# EAGLE design macropad (EAGLE 8.2.0)
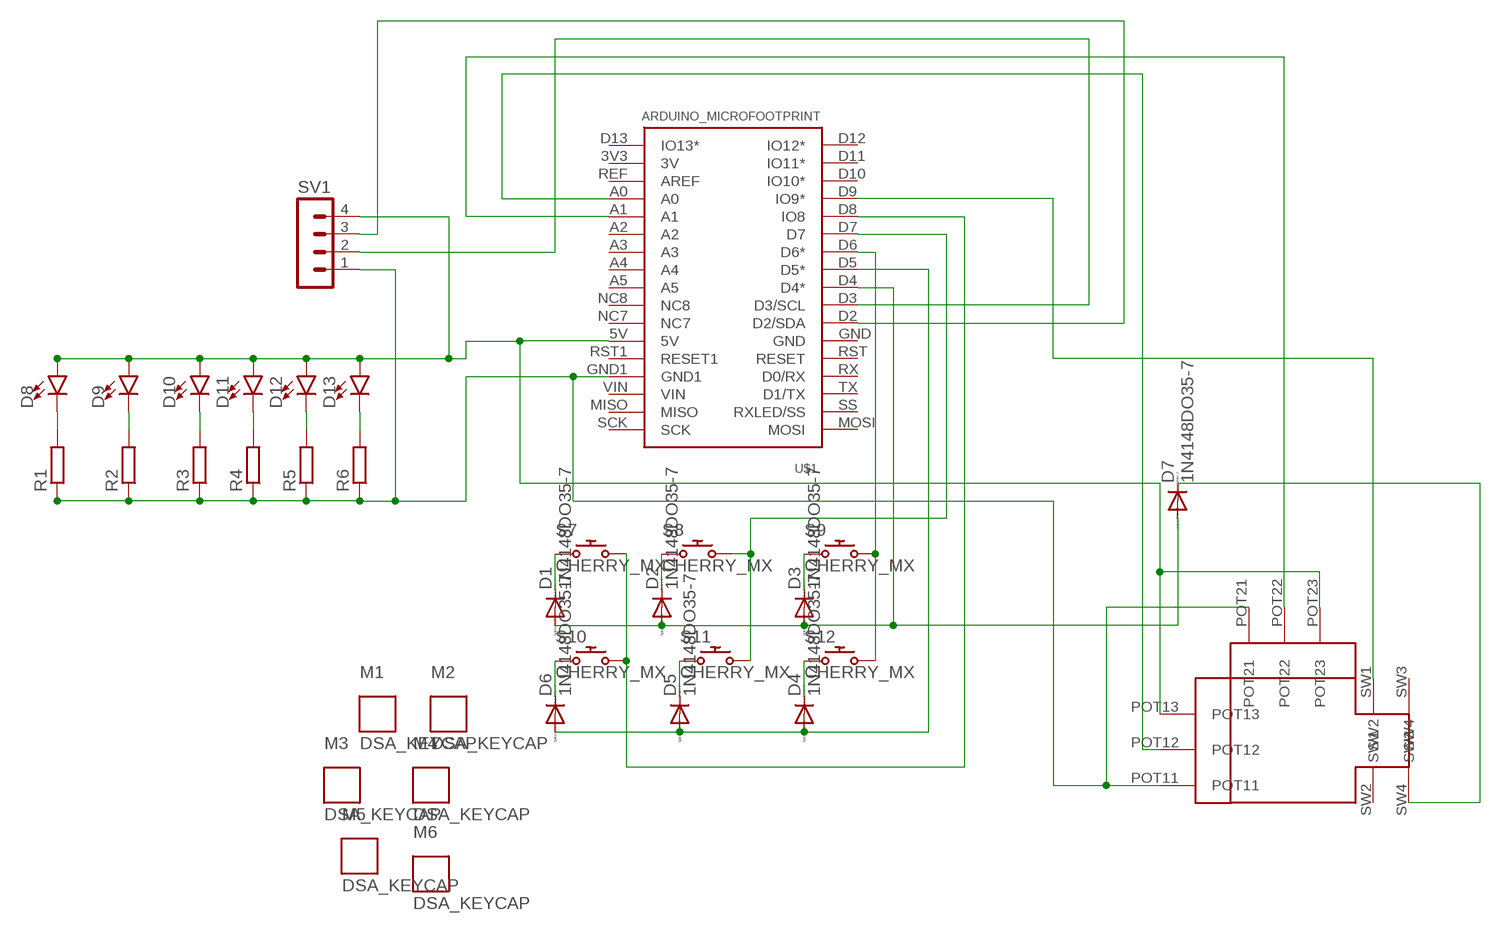
[diagram p0: schematic, sheet 1]

## Parts
D1  1N4148DO35-7  [DO35-7]
D2  1N4148DO35-7  [DO35-7]
D3  1N4148DO35-7  [DO35-7]
D4  1N4148DO35-7  [DO35-7]
D5  1N4148DO35-7  [DO35-7]
D6  1N4148DO35-7  [DO35-7]
D7  1N4148DO35-7  [DO35-7]
D8  LED-3MM-NO_SILK  [LED_3MM-NS]
D9  LED-3MM-NO_SILK  [LED_3MM-NS]
D10  LED-3MM-NO_SILK  [LED_3MM-NS]
D11  LED-3MM-NO_SILK  [LED_3MM-NS]
D12  LED-3MM-NO_SILK  [LED_3MM-NS]
D13  LED-3MM-NO_SILK  [LED_3MM-NS]
M1  DSA_KEYCAP  [DSA_KEYCAP]
M2  DSA_KEYCAP  [DSA_KEYCAP]
M3  DSA_KEYCAP  [DSA_KEYCAP]
M4  DSA_KEYCAP  [DSA_KEYCAP]
M5  DSA_KEYCAP  [DSA_KEYCAP]
M6  DSA_KEYCAP  [DSA_KEYCAP]
R1  R-EU_0204/7  [0204/7]
R2  R-EU_0204/7  [0204/7]
R3  R-EU_0204/7  [0204/7]
R4  R-EU_0204/7  [0204/7]
R5  R-EU_0204/7  [0204/7]
R6  R-EU_0204/7  [0204/7]
S7  CHERRY_MX  [CHERRY_MX]
S8  CHERRY_MX  [CHERRY_MX]
S9  CHERRY_MX  [CHERRY_MX]
S10  CHERRY_MX  [CHERRY_MX]
S11  CHERRY_MX  [CHERRY_MX]
S12  CHERRY_MX  [CHERRY_MX]
SV1  MA04-1  [MA04-1]
U$1  ARDUINO_MICROFOOTPRINT  [ARDUINO-MICRO]
U$2  JOYSTICK  [JOYSTICKONE]

## Nets
N$1: D5.C S11.S1
N$2: D1.C S7.S1
N$3: D6.C S10.S1
N$4: S7.S2 S10.S2 U$1.D8(IO8)
N$5: D2.C S8.S1
N$6: D3.C S9.S1
N$7: SV1.2 U$1.D3(D3/SCL)
N$9: S9.S2 S12.S2 U$1.D6(D6*)
N$10: D7.C U$2.SW4
N$11: D1.A D2.A D3.A D7.A U$1.D4(D4*)
N$12: D4.A D5.A D6.A U$1.D5(D5*)
N$14: SV1.3 U$1.D2(D2/SDA)
N$15: U$1.A0 U$2.POT12
N$16: U$1.A1 U$2.POT22
N$17: D4.C S12.S1
N$18: S8.S2 S11.S2 U$1.D7
N$23: U$1.D9(IO9*) U$2.SW1
N$24: D8.A D9.A D10.A D11.A D12.A D13.A SV1.4 U$1.5V U$2.POT13 U$2.POT23
N$25: D8.K(C) R1.2
N$26: D9.K(C) R2.2
N$27: D10.K(C) R3.2
N$28: D11.K(C) R4.2
N$29: D12.K(C) R5.2
N$30: D13.K(C) R6.2
N$31: R1.1 R2.1 R3.1 R4.1 R5.1 R6.1 SV1.1 U$1.GND1 U$2.POT11 U$2.POT21
Unconnected: U$1.3V3(3V) U$1.A2 U$1.A3 U$1.A4 U$1.A5 U$1.D10(IO10*) U$1.D11(IO11*) U$1.D12(IO12*) U$1.D13(IO13*) U$1.GND U$1.MISO U$1.MOSI U$1.NC7 U$1.NC8 U$1.REF(AREF) U$1.RST1(RESET1) U$1.RST(RESET) U$1.RX(D0/RX) U$1.SCK U$1.SS(RXLED/SS) U$1.TX(D1/TX) U$1.VIN U$2.SW2 U$2.SW3

## Library data of the parts
D1-D7 = diode:1N4148: DIODE high speed (Philips)
D8-D13 = ws2812b:LED: LED (Generic) Standard schematic elements and footprints for 5mm, 3mm, 1206, and 0603 sized LEDs. Generic LEDs with no color specified.
M1-M6 = cherry:DSA_KEYCAP: DSA keycap
R1-R6 = rcl:R-EU_: RESISTOR, European symbol
S7-S12 = cherry:CHERRY_MX: Cherry keymodule MX; FARNELL: 2292961; MOUSER: 540-MX1A-11NW
SV1 = con-lstb:MA04-1: PIN HEADER; OC_FARNELL: unknown; OC_NEWARK: unknown
U$1 = ArduinoMicro:ARDUINO_MICRO
U$2 = joystick one:JOYSTICK

## Board
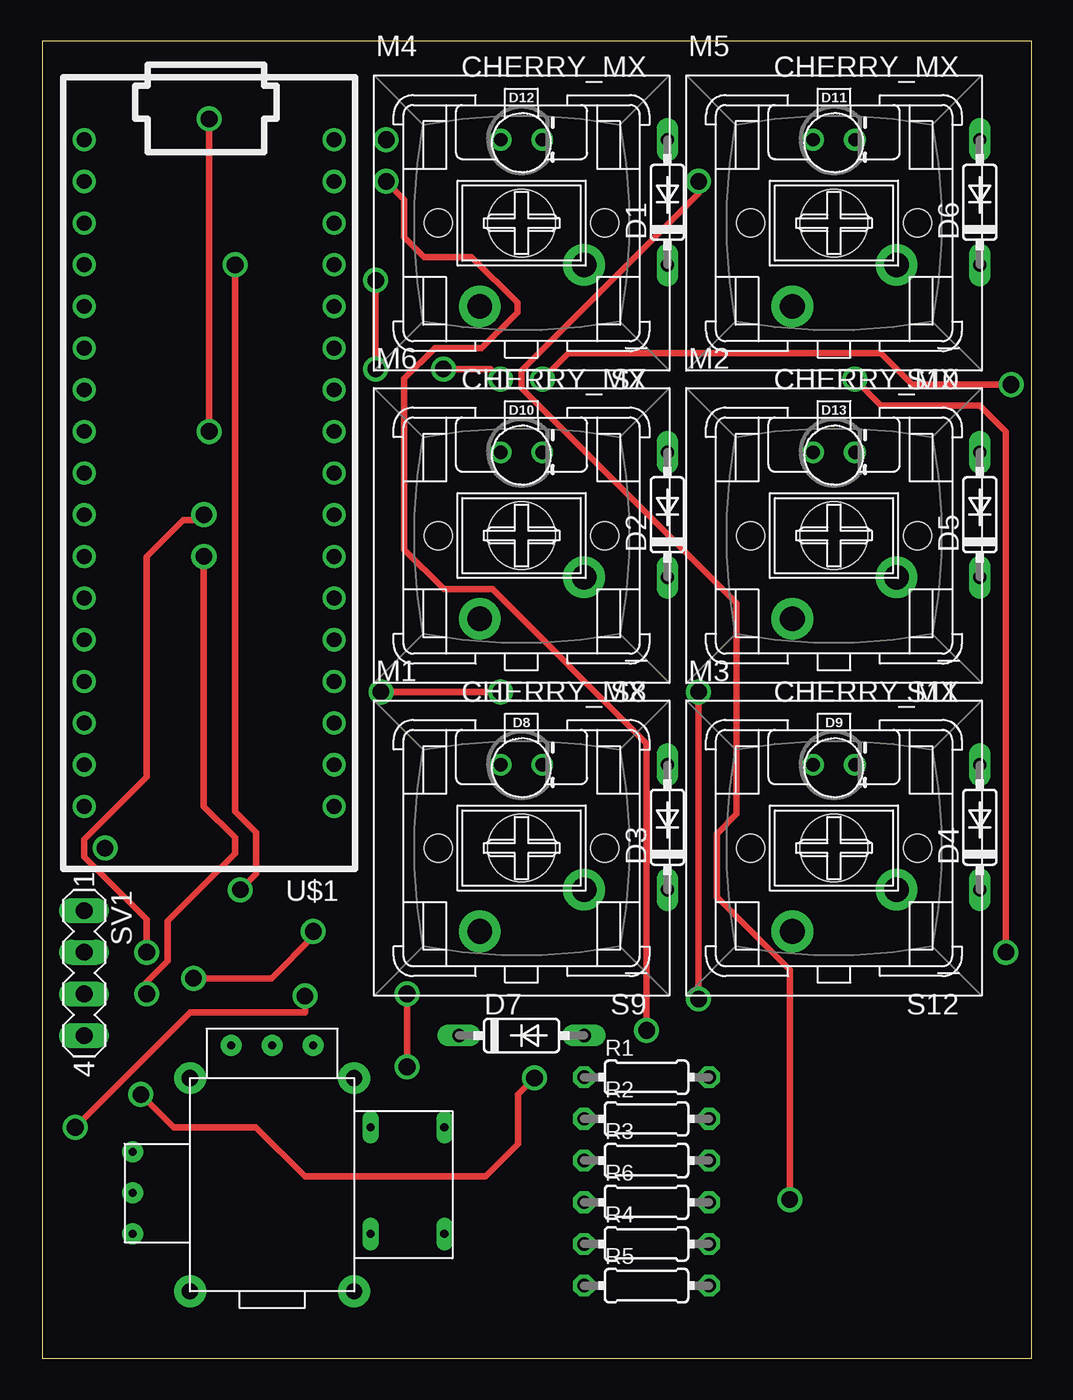
[diagram p1: board, top side]
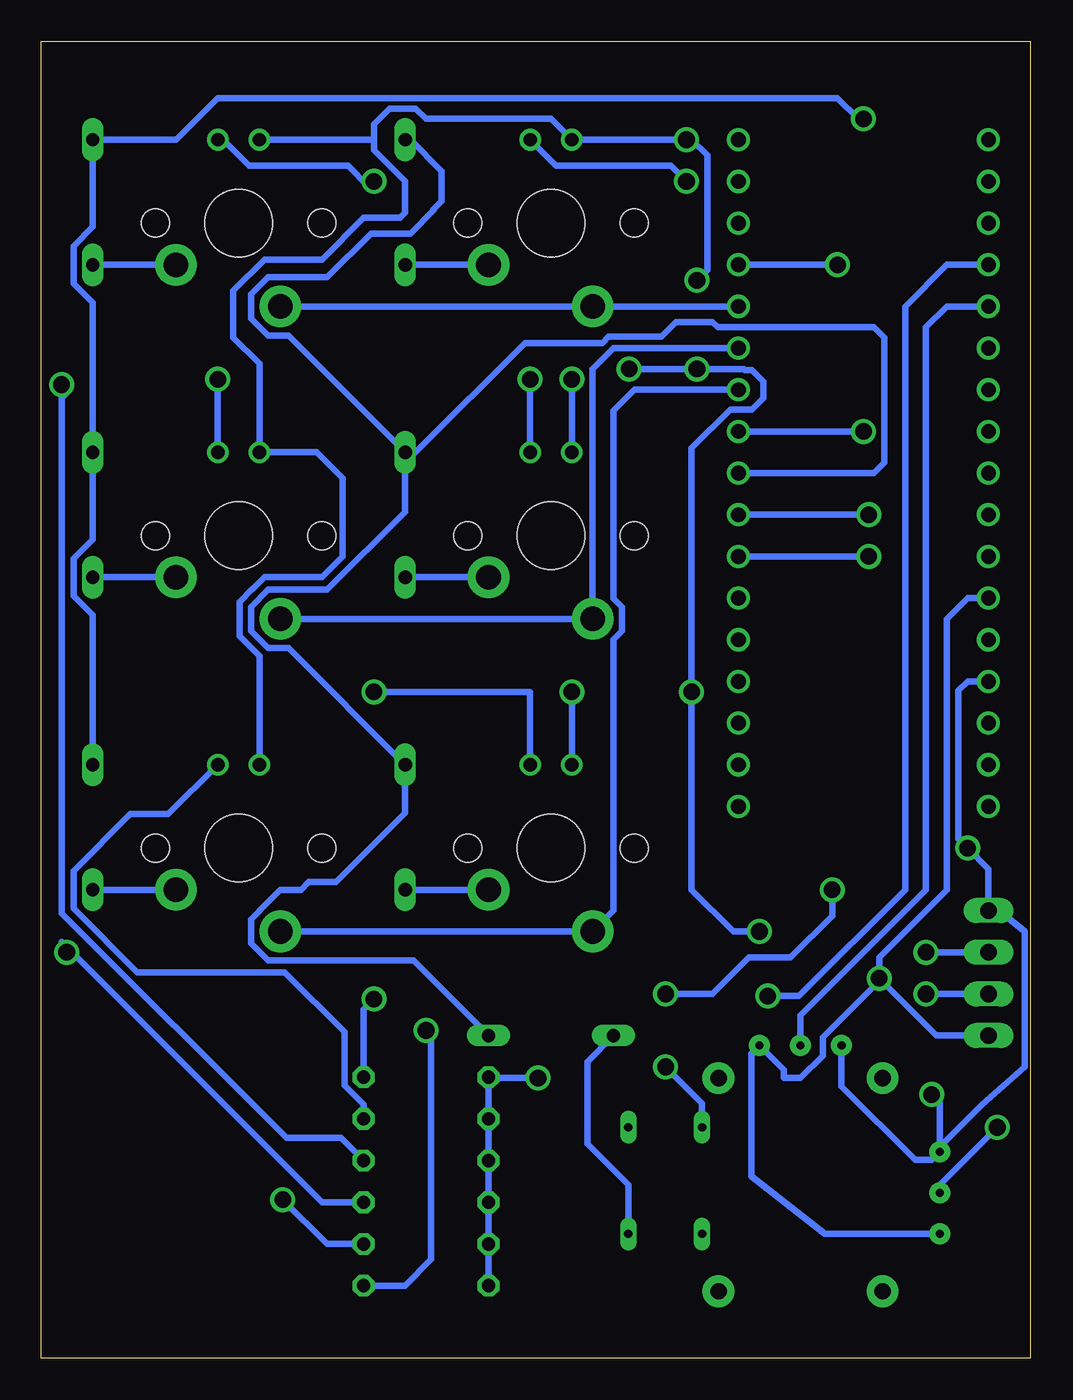
[diagram p2: board, bottom side, seen from below]

Size 60.3 x 80.31 mm. Coordinates in mm from the lower left corner, seen from the top.
Outline: 0,0 60.3,0 60.3,80.31 0,80.31 0,0
Copper layers (1*16): Top 0.035mm / dielectric 1.5mm / Bottom 0.035mm
Design rules "default *": minimum track width 6mil, minimum drill 0.35mm, track to track 12mil, track to pad 12mil, pad to pad 12mil, via to via 12mil, smd to smd 12mil, copper to edge 40mil, drill to drill 6mil, minimum pad ring 10mil, minimum via ring 8mil, stop-mask expansion 4mil, vias tented up to drill 0mil, thermal gap 10mil

### Footprints (pad centres in the part's own frame; a part is rotated, then mirrored left to right if it is on the bottom)
DO35-7 = drill 0.813 long: A 3.81,0; C -3.81,0
LED_3MM-NS = drill 0.813: A -1.27,0; K 1.27,0
0204/7 = drill 0.813 octagon: 1 -3.81,0; 2 3.81,0
CHERRY_MX = drill 1.5 pad 2.54: S1 -3.81,2.54; S2 2.54,5.08 | hole 1.7: -5.08,0; 5.08,0 | hole 4.1: 0,0
MA04-1 = drill 1.016 long: 1 -3.81,0; 2 -1.27,0; 3 1.27,0; 4 3.81,0
ARDUINO-MICRO = drill 0.9: 3V3 16.51,3.81; 5V 16.51,29.21; A0 16.51,8.89; A1 16.51,11.43; A2 16.51,13.97; A3 16.51,16.51; A4 16.51,19.05; A5 16.51,21.59; D2 1.27,26.67; D3 1.27,24.13; D4 1.27,21.59; D5 1.27,19.05; D6 1.27,16.51; D7 1.27,13.97; D8 1.27,11.43; D9 1.27,8.89; D10 1.27,6.35; D11 1.27,3.81; D12 1.27,1.27; D13 16.51,1.27; GND 1.27,29.21; GND1 16.51,34.29; MISO 16.51,39.37; MOSI 1.27,41.91; NC7 16.51,26.67; NC8 16.51,24.13; REF 16.51,6.35; RST 1.27,31.75; RST1 16.51,31.75; RX 1.27,34.29; SCK 16.51,41.91; SS 1.27,39.37; TX 1.27,36.83; VIN 16.51,36.83
JOYSTICKONE = drill 1 pad 1.93: BASE1 -15,8; BASE2 -5,8; BASE3 -5,-5; BASE4 -15,-5 | drill 0.5 pad 1.27: POT11 -18.5,3.5; POT12 -18.5,1; POT13 -18.5,-1.5; POT21 -12.5,10; POT22 -10,10; POT23 -7.5,10 | drill 0.5 long: SW1 -4,5; SW2 -4,-1.5; SW3 0.5,5; SW4 0.5,-1.5

### Placement (x,y rotation side)
D1  38.1,70.48 90 top
D2  38.1,51.44 90 top
D3  38.1,32.38 90 top
D4  57.15,32.38 90 top
D5  57.15,51.44 90 top
D6  57.15,70.48 90 top
D7  29.21,19.68 0 top
D8  29.21,36.2 0 top
D9  48.26,36.2 0 top
D10  29.21,55.24 0 top
D11  48.26,74.3 0 top
D12  29.21,74.3 0 top
D13  48.26,55.24 0 top
M1  29.21,31.12 0 top
M2  48.26,50.16 0 top
M3  48.26,31.12 0 top
M4  29.21,69.22 0 top
M5  48.26,69.22 0 top
M6  29.21,50.16 0 top
R1  36.83,17.14 0 top
R2  36.83,14.61 0 top
R3  36.83,12.07 0 top
R4  36.83,6.99 0 top
R5  36.83,4.44 0 top
R6  36.83,9.53 0 top
S7  29.21,69.22 180 top
S8  29.21,50.16 180 top
S9  29.21,31.12 180 top
S10  48.26,69.22 180 top
S11  48.26,50.16 180 top
S12  48.26,31.12 180 top
SV1  2.54,23.49 270 top
U$1  19.05,75.56 180 top
U$2  24,9.1 0 top

### Tracks (layer width: path | path; a pad name or v marks a point on that pad's centre or on a via)
N$1
  Bottom 0.406: S11.S1 D5.C
N$2
  Bottom 0.406: S7.S1 D1.C
N$3
  Bottom 0.406: S10.S1 D6.C
N$4
  Bottom 0.406: S10.S2 S7.S2 U$1.D8
N$5
  Bottom 0.406: S8.S1 D2.C
N$6
  Bottom 0.406: S9.S1 D3.C
N$7  (via drill 1.02)
  Top 0.406: v6.35,24.77 6.35,26.78 2.54,30.59 2.54,31.64 6.35,35.45 6.35,48.89 8.57,51.12 9.21,51.12 9.53,51.44 v9.84,51.44
  Bottom 0.406: SV1.2 v6.35,24.77 | v9.84,51.44 U$1.D3
N$9
  Bottom 0.406: S12.S2 S9.S2 25.4,27.3 25.4,43.84 24.89,44.35 24.89,45.82 25.4,46.33 25.4,57.78 24.13,59.05 U$1.D6
N$10
  Bottom 0.406: U$2.SW4 24.5,10.6 27,13.1 27,18.08 D7.C
N$11
  Bottom 0.406: D2.A 38.1,51.61 42.85,46.86 46.46,46.86 47.5,45.82 47.5,44.35 46.46,43.31 45.21,43.31 D3.A 38.1,33.27 42.32,29.05 43.98,29.05 44.45,28.57 45.72,28.57 46.99,27.3 46.99,27.28 47.5,26.77 47.5,25.3 46.46,24.26 37.59,24.26 D7.A | D2.A 45.21,62.36 46.46,62.36 47.5,63.4 47.5,64.87 46.46,65.91 42.85,65.91 40.18,68.58 37.78,68.58 36.36,70 36.36,70.07 35.88,70.55 35.88,72.39 37.78,74.3 D1.A | D2.A 37.47,55.24 30.8,61.91 26.09,61.91 25.7,62.31 22.47,62.31 21.59,63.18 19.37,63.18 19.05,62.86 9.53,62.86 8.89,62.23 8.89,54.61 9.53,53.98 U$1.D4
N$12  (via drill 1.02)
  Top 0.406: v10.16,56.52 v10.16,75.56
  Bottom 0.406: D4.A 57.15,45.31 58.32,46.48 58.32,48.77 57.15,49.94 D5.A 57.15,64.36 58.32,65.53 58.32,67.82 57.15,68.99 D6.A 52.07,74.3 49.53,76.83 11.75,76.83 10.48,75.56 v10.16,75.56 | U$1.D5 v10.16,56.52
N$14  (via drill 1.02)
  Top 0.406: v6.35,22.22 6.35,22.97 7.62,24.24 7.62,26.67 11.75,30.8 11.75,31.75 9.84,33.66 v9.84,48.89
  Bottom 0.406: SV1.3 v6.35,22.22 | U$1.D2 v9.84,48.89
N$15  (via drill 1.02 pad 0.01)
  Top 0.406: v2,14.1 9,21.09 16,21.09 v16,22.09
  Bottom 0.406: U$1.A0 5.08,66.67 7.62,64.14 7.62,28.57 14.1,22.09 v16,22.09 | U$2.POT12 5.5,10.6 v2,14.1
N$16
  Bottom 0.406: U$1.A1 5.08,64.14 6.35,62.86 6.35,28.57 14,20.92 U$2.POT22
N$17
  Bottom 0.406: S12.S1 D4.C
N$18
  Bottom 0.406: S11.S2 S8.S2 26.67,60.32 25.4,61.59 U$1.D7
N$23  (via drill 1.02)
  Top 0.406: v11.75,66.67 11.75,33.34 13.02,32.07 13.02,29.53 v12.06,28.57 | v22.23,22.22 v22.23,17.78
  Bottom 0.406: 22.54,18.1 v22.23,17.78 20,15.56 U$2.SW1 | U$1.D9 v11.75,66.67 | v12.06,28.57 12.06,26.99 14.61,24.45 17.14,24.45 19.37,22.22 v22.23,22.22
N$24  (via drill 1.02)
  Top 0.406: v16.51,26.04 16.51,25.72 13.97,23.18 v9.21,23.18 | v20.64,40.64 v27.94,40.64 | v24.45,60.32 27.3,60.32 v27.94,59.69 | v20.32,65.72 v20.32,60.32
  Bottom 0.406: U$1.5V 3.81,46.35 5.08,45.09 5.08,28.57 9.21,24.45 v9.21,23.18 | D8.A v27.94,40.64 | D10.A v27.94,59.69 | D9.A 46.99,42.84 48.21,44.05 48.21,46.12 47.43,46.9 47.4,46.9 46.67,47.62 43.18,47.62 41.91,48.89 41.91,53.66 43.5,55.24 D13.A 46.99,60.64 48.58,62.23 48.58,65.09 46.67,66.99 43.18,66.99 40.64,69.53 38.42,69.53 38.1,69.85 38.1,71.75 40.01,73.66 40.01,74.3 | D11.A 40.01,74.3 | v16.51,26.04 18.1,26.04 20.64,28.57 20.64,40.32 20.95,40.64 v20.64,40.64 20.64,55.49 18.28,57.84 16.96,57.84 16.25,58.55 16.25,59.56 16.96,60.27 17.4,60.27 17.46,60.32 v20.32,60.32 v24.45,60.32 | v20.32,65.72 19.68,66.36 19.68,73.34 20.64,74.3 v20.95,74.3 D12.A 29.21,75.56 36.83,75.56 37.47,76.2 39.05,76.2 40.01,75.25 40.01,74.3 | U$2.POT13 12.5,7.59 17,11.1 17,18.59 16.25,18.84 | 16.25,18.84 U$2.POT23 | SV1.4 5.71,19.68 v9.21,23.18 | v9.21,23.18 9.21,23 12.64,19.57 12.64,18.45 14,17.09 15,17.09 15,17.59 16.25,18.84
N$25  (via drill 1.02)
  Top 0.406: v40.01,21.91 v40.01,40.64
  Bottom 0.406: D8.K 30.48,40.64 v40.01,40.64 | R1.2 40.64,21.27 v40.01,21.91
N$26
  Bottom 0.406: R2.2 40.64,15.49 41.81,16.66 41.81,19.9 45.45,23.55 54.43,23.55 58.32,27.43 58.32,29.72 54.85,33.18 52.54,33.18 D9.K
N$27  (via drill 1.02)
  Top 0.406: v59.05,59.37 53.02,59.37 51.12,61.28 32.07,61.28 v30.48,59.69
  Bottom 0.406: D10.K v30.48,59.69 | R3.2 42.01,13.44 45.33,13.44 59.03,27.14 59.03,58.56 58.74,58.85 58.74,59.69 v59.05,59.37
N$28  (via drill 1.02)
  Top 0.406: v45.56,9.68 45.56,23.68 41.11,28.13 41.11,31.97 42.32,33.18 42.32,46.05 29.21,59.16 29.21,60.22 40.01,71.01 v40.01,71.75
  Bottom 0.406: D11.K 49.21,74.3 47.62,72.71 41.59,72.71 40.32,71.44 v40.01,71.75 | R4.2 42.86,6.99 v45.56,9.68 | v45.56,9.68 45.72,9.84 v45.56,9.68
N$29  (via drill 1.02)
  Top 0.406: v20.95,71.75 22.06,70.65 22.06,68.36 23.27,67.15 26.17,67.15 28.95,64.37 28.95,63.76 26.78,61.59 23.92,61.59 22.06,59.73 22.06,49.31 24.47,46.9 27.43,46.9 36.83,37.5 v36.83,20
  Bottom 0.406: D12.K 28.89,72.71 21.91,72.71 v20.95,71.75 | R5.2 38.1,4.44 36.51,6.03 36.51,19.68 v36.83,20
N$30  (via drill 1.02)
  Top 0.406: v58.74,24.77 58.74,56.52 57.15,58.1 51.12,58.1 v49.53,59.69
  Bottom 0.406: D13.K v49.53,59.69 | R6.2 43.18,9.53 59.05,25.4 59.05,25.08 v58.74,24.77
N$31  (via drill 1.02, 1.02 pad 0.01)
  Top 0.406: v6,16.09 8,14.1 13,14.1 16,11.1 27,11.1 29,13.1 29,16.09 v30,17.09
  Bottom 0.406: U$1.GND1 3.81,41.27 4.37,40.72 4.37,31.67 v3.81,31.12 | v3.81,31.12 4.37,31.12 | v3.81,31.12 2.54,29.84 SV1.1 1.91,27.3 0.32,26.04 0.32,17.78 2.95,15.47 5.5,12.92 U$2.POT11 | R5.1 R4.1 R6.1 R3.1 R2.1 R1.1 32.97,17.09 v30,17.09 | U$2.POT21 11.5,16.59 7,12.1 6,12.1 U$2.POT11 | U$2.POT11 5.5,15.6 v6,16.09